# Altium schematic sheet Célula 3.SchDoc
size A
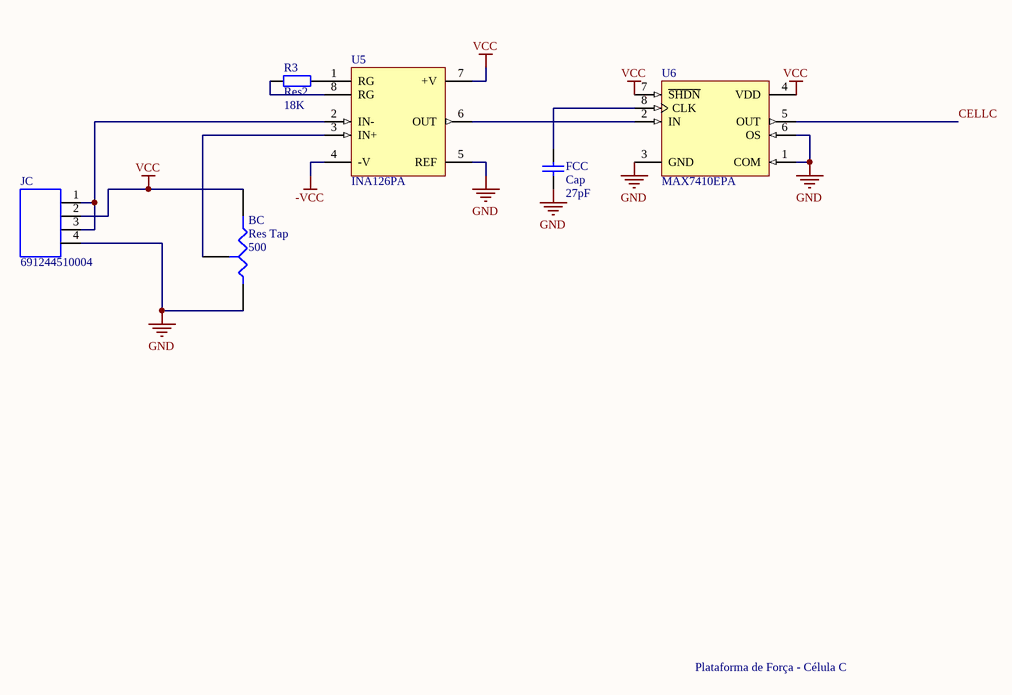
[diagram p0: Célula 3.SchDoc]

## Parts
BC  Res Tap  value 500  [TSR3006]
FCC  Cap  value 27pF  [RAD-0.3]
JC  691244510004  [691244510004]
R3  Res2  value 18K  [AXIAL-0.4]
U5  INA126PA  [006E]
U6  MAX7410EPA  [PA8]

## Nets
-VCC: U5.4(-V)
GND: BC.1(A) FCC.1 JC.4 U5.5(REF) U6.1(COM) U6.3(GND) U6.6(OS)
VCC: BC.2(B) JC.2 U5.7(+V) U6.4(VDD) U6.7(~{SHDN})
CELLC: U6.5(OUT)
NetBC_3: BC.3(TAP) U5.3(IN+)
NetFCC_2: FCC.2 U6.8(CLK)
NetJC_1: JC.1 JC.3 U5.2(IN-)
NetR3_1: R3.1 U5.8(RG)
NetR3_2: R3.2 U5.1(RG)
NetU5_6: U5.6(OUT) U6.2(IN)

## Notes on the sheet
- Plataforma de Força - Célula C

## Library data of the parts
BC = Res Tap: Tapped Resistor; Sim Note: Enter the Resistance value and the set point into parameter fields.; Set Position: 0.5; Published: 24-Mar-1999; LatestRevisionDate: 17-Jul-2002; LatestRevisionNote: Re-released for DXP Platform.; PackageReference: VR3; Publisher: Altium Limited; PackageDescription: Variable Resistor, Thru-Hole; 3 Leads
FCC = Cap: Capacitor; Published: 8-Jun-2000; LatestRevisionDate: 17-Jul-2002; LatestRevisionNote: Re-released for DXP Platform.; PackageReference: RAD-0.3; Publisher: Altium Limited; PackageDescription: Radial Cap, Thru-Hole; 2 Leads; 0.3 in Pin Spacing
JC = 691244510004: WR-TBL Horizontal Cable Entry With Rising Cage Clamp,Serie 2445 - 5.08 mm; Manufacturer: Wurth Elektronik; ComponentLink1 Description: Manufacturer; ComponentLink2 Description: Datasheet; ComponentLink1URL: http://www.we-online.de; ComponentLink2URL: http://katalog.we-online.de/em/datasheet/6912445100XX.pdf; Created by: Baojun Chen; Created Date: 15.Sep.2015; partNo: 691244510004
R3 = Res2: Resistor; Published: 8-Jun-2000; LatestRevisionDate: 17-Jul-2002; LatestRevisionNote: Re-released for DXP Platform.; PackageReference: AXIAL-0.4; Publisher: Altium Limited; PackageDescription: Axial Device, Thru-Hole; 2 Leads; 0.4 in Pin Spacing
U5 = INA126PA: Precision, Low-Power Instrumentation Amplifiers; Published: 8-Jun-2000; LatestRevisionDate: 06-Jun-2005; LatestRevisionNote: Stylized 3D Model Added.; DatasheetVersion: Oct-1996; PackageVersion: revE; PackageReference: 006E; Publisher: Altium Limited; PackageDescription: DIP; 8 Leads; Row Spacing 7.62 mm; Pitch 2.54 mm; ComponentLink1Description: Manufacturer Link; ComponentLink1URL: http://www.ti.com/; ComponentLink2Description: Datasheet; ComponentLink2URL: http://www-s.ti.com/sc/ds/INA128.pdf
U6 = MAX7410EPA: 5th-Order, Lowpass, Switched-Capacitor Filter; Published: 16-Jan-2001; LatestRevisionDate: 29-May-2009; LatestRevisionNote: Component Body Added.; DatasheetVersion: Sep-1998; PackageVersion: RevB, 21-0043; PackageReference: PA8; Publisher: Altium Limited; PackageDescription: DIP, 8-Pin, Row Spacing 7.62 mm, Pitch 2.54 mm; Code_JEDEC: MS-001-AB; ComponentLink1Description: Manufacturer Link; ComponentLink1URL: http://www.maxim-ic.com/; ComponentLink2Description: Datasheet; ComponentLink2URL: http://pdfserv.maxim-ic.com/en/ds/MAX7409-MAX7414.pdf